# Altium project pca20020.PrjPCB (part 1 of 3)
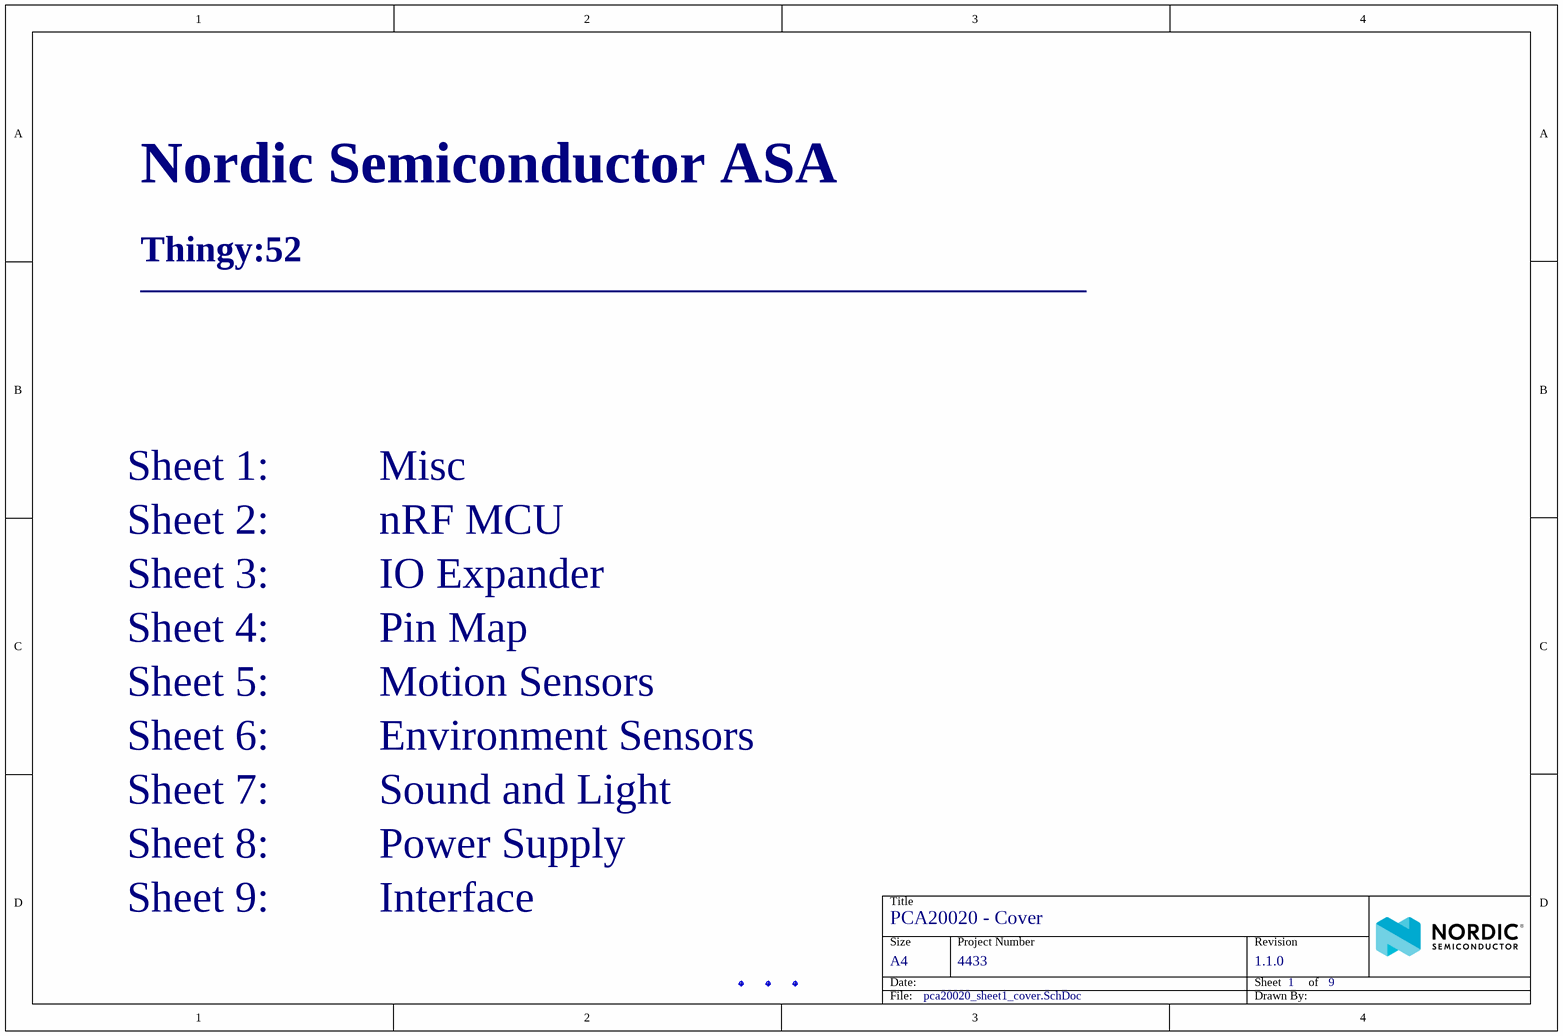
[diagram p0: pca20020_sheet1_cover.SchDoc]
SurfaceFinish: Lead-Free HASL; SoldermaskColor: Blue; SilkscreenColor: White; Revision: 1.1.0; ProjectNumber: 4433; ProjectName: Thingy:52; PCBStackup: 2001; PCBRevision: 0333RUBR; PCBNumber: 400182; PCAName: PCA20020; Organization: Nordic Semiconductor; NrOfLayers: 2; BoardTitle: Thingy:52 Board; BoardThickness: 1.6mm; Author: RUBR
9 sheets, 166 parts. Net scope: flat (ports and power ports of the same name join across sheets).
Board file: 400182.PcbDoc
Sheets:
  pca20020_sheet1_cover.SchDoc
  pca20020_sheet2_mcu.SchDoc
  pca20020_sheet3_io_expander.SchDoc
  pca20020_sheet4_pin_map.SchDoc
  pca20020_sheet5_motion_sensors.SchDoc
  pca20020_sheet6_environment_sensors.SchDoc
  pca20020_sheet7_sound_and_light.SchDoc
  pca20020_sheet8_power_supply.SchDoc
  pca20020_sheet9_interface.SchDoc

## Sheet pca20020_sheet1_cover.SchDoc: PCA20020 - Cover
size A4; Organization: Nordic Semiconductor; DocumentNumber: 1; Revision: 1.1.0; SheetNumber: 1; SheetTotal: 9; Author: RUBR; CompanyName: Nordic Semiconductor; DrawnBy: RUBR; DocumentSize: A4; ProjectName: Thingy:52

### Parts
Fid1  Fiducial mark  [Fiducial_Round-Square]  (value not drawn)
Fid2  Fiducial mark  [Fiducial_Round-Square]  (value not drawn)
Fid3  Fiducial mark  [Fiducial_Round-Square]  (value not drawn)

### Notes on the sheet
- Nordic Semiconductor ASA
- Thingy:52
- ___________________________________________
- Sheet 1:          Misc
- Sheet 2:          nRF MCU
- Sheet 4:          Pin Map
- Sheet 3:          IO Expander
- Sheet 5:          Motion Sensors
- Sheet 6:          Environment Sensors
- Sheet 7:          Sound and Light
- Sheet 8:          Power Supply
- Sheet 9:          Interface
- Title
- Size
- Date:
- A4
- Project Number
- Sheet         of
- Revision
- File:
- Drawn By:

### Library data of the parts
Fid1-Fid3 = Fid-Mark-Round-Square: Artikkelnr Noca: N.A.; Part Number: Fid-Mark-Round-Square; Manufacturer: *; Manufacturer Part Number: *; LatestRevisionDate: 2017-01-30; Pin Count: 1; Publisher: Nordic Semiconductor; Published: 2009-12-12; Value: *; Note: *; Footprint Doc: Fiducial; Part number IPS: N.A.; ComponentLink1URL: *; ComponentLink1Description: Datasheet; ComponentLink2URL: *; ComponentLink2Description: Supplier link; HelpURL: *; Supplier 1: *; Supplier Part Number 1: *; Supplier 2: *; Supplier Part Number 2: *

## Sheet pca20020_sheet2_mcu.SchDoc: PCA20020 - nRF MCU
size A4; Organization: Nordic Semiconductor; DocumentNumber: 2; Revision: 1.1.0; SheetNumber: 2; SheetTotal: 9; Author: RUBR; CompanyName: Nordic Semiconductor; DrawnBy: RUBR; DocumentSize: A4; ProjectName: Thingy:52
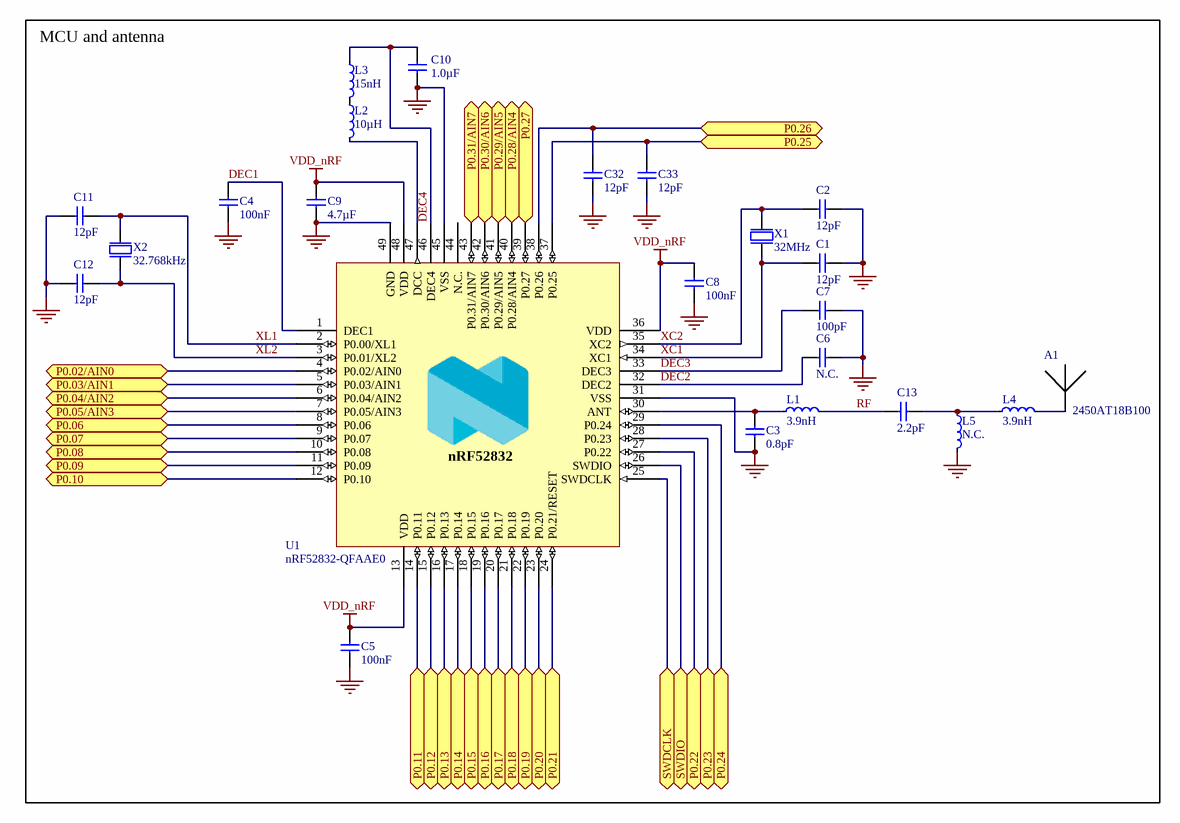
[diagram p1: pca20020_sheet2_mcu.SchDoc]

### Parts
A1  2450AT18B100  [2450AT18B100]
C1  12pF  [CAPC1005X04L]
C2  12pF  [CAPC1005X04L]
C3  0.8pF  [CAPC1005X04L]
C4  100nF  [CAPC1005X04L]
C5  100nF  [CAPC1005X04L]
C6  N.C.  [CAPC1005X04L]
C7  100pF  [CAPC1005X04L]
C8  100nF  [CAPC1005X04L]
C9  4.7µF  [CAPC1608X06L]
C10  1.0µF  [CAPC1608X06L]
C11  12pF  [CAPC1005X04L]
C12  12pF  [CAPC1005X04L]
C13  2.2pF  [CAPC1005X04L]
C32  12pF  [CAPC1005X04L]
C33  12pF  [CAPC1005X04L]
L1  3.9nH  [INDC1005X04L]
L2  10µH  [INDC1608X06L]
L3  15nH  [INDC1005X04L]
L4  3.9nH  [INDC1005X04L]
L5  N.C.  [INDC1005X04L]
U1  nRF52832-QFAAE0  [QFN40P600X600X90-48N]
X1  32MHz  [BT-XTAL_2016]
X2  32.768kHz  [XTAL_2012]

### Blocks framed on the sheet
MCU and antenna: A1 C1-C13 C32 C33 L1-L5 U1 X1 X2

### Ports
P0.02/AIN0 (bidir), P0.03/AIN1 (bidir), P0.04/AIN2 (bidir), P0.05/AIN3 (bidir), P0.06 (bidir), P0.07 (bidir), P0.08 (bidir), P0.09 (bidir), P0.10 (bidir), P0.11 (bidir), P0.12 (bidir), P0.13 (bidir), P0.14 (bidir), P0.15 (bidir), P0.16 (bidir), P0.17 (bidir), P0.18 (bidir), P0.19 (bidir), P0.20 (bidir), P0.21 (bidir), P0.22 (bidir), P0.23 (bidir), P0.24 (bidir), P0.25 (bidir), P0.26 (bidir), P0.27 (bidir), P0.28/AIN4 (bidir), P0.29/AIN5 (bidir), P0.30/AIN6 (bidir), P0.31/AIN7 (bidir), SWDCLK (bidir), SWDIO (bidir)

### Nets
GND: C1.2 C2.2 C3.1 C4.2 C5.2 C6.1 C7.2 C8.2 C9.2 C10.1 C11.2 C12.2 C32.1 C33.1 L5.2 U1.31(VSS) U1.45(VSS) U1.49(GND) X1.2(GND) X1.4(GND)
VDD_nRF: C5.1 C8.1 C9.1 U1.13(VDD) U1.36(VDD) U1.48(VDD)
DEC1: C4.1 U1.1(DEC1)
DEC2: C6.2 U1.32(DEC2)
DEC3: C7.1 U1.33(DEC3)
DEC4: C10.2 L3.1 U1.46(DEC4)
P0.02: U1.4(P0.02/AIN0) ; port P0.02/AIN0
P0.03: U1.5(P0.03/AIN1) ; port P0.03/AIN1
P0.04: U1.6(P0.04/AIN2) ; port P0.04/AIN2
P0.05: U1.7(P0.05/AIN3) ; port P0.05/AIN3
P0.06: U1.8(P0.06) ; port P0.06
P0.07: U1.9(P0.07) ; port P0.07
P0.08: U1.10(P0.08) ; port P0.08
P0.09: U1.11(P0.09) ; port P0.09
P0.10: U1.12(P0.10) ; port P0.10
P0.11: U1.14(P0.11) ; port P0.11
P0.12: U1.15(P0.12) ; port P0.12
P0.13: U1.16(P0.13) ; port P0.13
P0.14: U1.17(P0.14) ; port P0.14
P0.15: U1.18(P0.15) ; port P0.15
P0.16: U1.19(P0.16) ; port P0.16
P0.17: U1.20(P0.17) ; port P0.17
P0.18: U1.21(P0.18) ; port P0.18
P0.19: U1.22(P0.19) ; port P0.19
P0.20: U1.23(P0.20) ; port P0.20
P0.21: U1.24(P0.21/RESET) ; port P0.21
P0.22: U1.27(P0.22) ; port P0.22
P0.23: U1.28(P0.23) ; port P0.23
P0.24: U1.29(P0.24) ; port P0.24
P0.25: C33.2 U1.37(P0.25) ; port P0.25
P0.26: C32.2 U1.38(P0.26) ; port P0.26
P0.27: U1.39(P0.27) ; port P0.27
P0.28: U1.40(P0.28/AIN4) ; port P0.28/AIN4
P0.29: U1.41(P0.29/AIN5) ; port P0.29/AIN5
P0.30: U1.42(P0.30/AIN6) ; port P0.30/AIN6
P0.31: U1.43(P0.31/AIN7) ; port P0.31/AIN7
RF: C13.2 L1.2
SWDCLK: U1.25(SWDCLK) ; port SWDCLK
SWDIO: U1.26(SWDIO) ; port SWDIO
XC1: C1.1 U1.34(XC1) X1.1(inp)
XC2: C2.1 U1.35(XC2) X1.3(out)
XL1: C11.1 U1.2(P0.00/XL1) X2.1(inp)
XL2: C12.1 U1.3(P0.01/XL2) X2.2(out)
NetA1_1: A1.1 L4.2
NetC3_2: C3.2 L1.1 U1.30(ANT)
NetC13_1: C13.1 L4.1 L5.1
NetL2_1: L2.1 L3.2
NetL2_2: L2.2 U1.47(DCC)

Not connected (* = marked no-connect by the designer): U1 44(N.C.)

### Notes on the sheet
- Title
- Size
- Date:
- A4
- Project Number
- Sheet         of
- Revision
- File:
- Drawn By:
- (in symbol nRF52832-QFAAE0) nRF52832

### Library data of the parts
A1 = Johanson 2450AT18B100: 2.45 GHz chip antenna; Manufacturer: Johanson Technology; Part number IPS: 00000007781; Artikkelnr Noca: N.A.; Part Number: Johanson 2450AT18B100; Manufacturer Part Number: 2450AT18B100; Footprint Doc: 2450AT18B100; LatestRevisionDate: 2013-09-13; Pin Count: 2; Publisher: Nordic Semiconductor; Published: 2013-09-13; Value: 2450AT18B100; Note: *; ComponentLink1URL: *; ComponentLink1Description: Datasheet; ComponentLink2URL: *; ComponentLink2Description: Supplier link; HelpURL: http://www.johansontechnology.com/datasheets/antennas/2450AT18B100.pdf; Supplier 1: Digi-Key; Supplier Part Number 1: 712-1006-1-ND; Supplier 2: *; Supplier Part Number 2: *
C1 C2 C11 C12 C32 C33 = C0402-12p: Capacitor, NP0, ±2%; Part number IPS: 00000002398; Note: 50V; Artikkelnr Noca: 20029159; Part Number: C0402-12p; Manufacturer: *; Manufacturer Part Number: *; LatestRevisionDate: 2011-05-11; Pin Count: 2; Publisher: Nordic Semiconductor; Published: 2009-05-08; Value: 12pF; Footprint Doc: 0402; ComponentLink1URL: *; ComponentLink1Description: Datasheet; ComponentLink2URL: *; ComponentLink2Description: Supplier link; HelpURL: *; Supplier 1: *; Supplier Part Number 1: *; Supplier 2: *; Supplier Part Number 2: *
C3 = C0402-0.8p: Capacitor, NP0, ±5%; Part number IPS: 00000007782; Note: 50V; Artikkelnr Noca: 20029147; Part Number: C0402-0.8p; Manufacturer: *; Manufacturer Part Number: *; LatestRevisionDate: 2012-11-21; Pin Count: 2; Publisher: Nordic Semiconductor; Published: 2009-05-08; Value: 0.8pF; Footprint Doc: 0402; ComponentLink1URL: *; ComponentLink1Description: Datasheet; ComponentLink2URL: *; ComponentLink2Description: Supplier link; HelpURL: *; Supplier 1: *; Supplier Part Number 1: *; Supplier 2: *; Supplier Part Number 2: *
C4 C5 C8 = C0402-100n: Capacitor, X7R, ±10%; Part number IPS: 00000005296; Note: 16V; Artikkelnr Noca: 20039200; Part Number: C0402-100n; Manufacturer: *; Manufacturer Part Number: *; LatestRevisionDate: 2009-11-23; Pin Count: 2; Publisher: Nordic Semiconductor; Published: 2009-05-08; Value: 100nF; Footprint Doc: 0402; ComponentLink1URL: *; ComponentLink1Description: Datasheet; ComponentLink2URL: *; ComponentLink2Description: Supplier link; HelpURL: *; Supplier 1: *; Supplier Part Number 1: *; Supplier 2: *; Supplier Part Number 2: *
C6 = C0402-N.C.: Not mounted; Note: Chip Cap; Artikkelnr Noca: N.A.; Assembly: Not mounted; Part Number: C0402-N.C.; Manufacturer: *; Manufacturer Part Number: *; LatestRevisionDate: 2009-05-08; Pin Count: 2; Publisher: Nordic Semiconductor; Published: 2009-05-08; Value: N.C.; Footprint Doc: 0402; Part number IPS: N.A.; ComponentLink1URL: *; ComponentLink1Description: Datasheet; ComponentLink2URL: *; ComponentLink2Description: Supplier link; HelpURL: *; Supplier 1: *; Supplier Part Number 1: *; Supplier 2: *; Supplier Part Number 2: *
C7 = C0402-100p: Capacitor, NP0, ±5%; Part number IPS: 00000002361; Note: 50V; Artikkelnr Noca: 20029135; Part Number: C0402-100p; Manufacturer: *; Manufacturer Part Number: *; LatestRevisionDate: 2009-05-08; Pin Count: 2; Publisher: Nordic Semiconductor; Published: 2009-05-08; Value: 100pF; Footprint Doc: 0402; ComponentLink1URL: *; ComponentLink1Description: Datasheet; ComponentLink2URL: *; ComponentLink2Description: Supplier link; HelpURL: *; Supplier 1: *; Supplier Part Number 1: *; Supplier 2: *; Supplier Part Number 2: *
C9 = C0603-4µ7: Capacitor, X5R, ±10%; Part number IPS: 00000007783; Note: 6.3V; Artikkelnr Noca: 20069060; Part Number: C0603-4µ7; Manufacturer: *; Manufacturer Part Number: *; LatestRevisionDate: 2009-11-23; Pin Count: 2; Publisher: Nordic Semiconductor; Published: 2009-05-08; Value: 4.7µF; Footprint Doc: 0603; ComponentLink1URL: *; ComponentLink1Description: Datasheet; ComponentLink2URL: *; ComponentLink2Description: Supplier link; HelpURL: *; Supplier 1: *; Supplier Part Number 1: *; Supplier 2: *; Supplier Part Number 2: *
C10 = C0603-1µ0: Capacitor, X7R, ±10%; Part number IPS: 00000000616; Note: 16V; Artikkelnr Noca: 20039282; Part Number: C0603-1µ0; Manufacturer: *; Manufacturer Part Number: *; LatestRevisionDate: 2013-06-05; Pin Count: 2; Publisher: Nordic Semiconductor; Published: 2009-05-08; Value: 1.0µF; Footprint Doc: 0603; ComponentLink1URL: *; ComponentLink1Description: Datasheet; ComponentLink2URL: *; ComponentLink2Description: Supplier link; HelpURL: *; Supplier 1: *; Supplier Part Number 1: *; Supplier 2: *; Supplier Part Number 2: *
C13 = C0402-2.2p: Capacitor, NP0, ±0.1pF; Part number IPS: 00000003105; Note: 50V; Artikkelnr Noca: 20029145; Part Number: C0402-2.2p; Manufacturer: *; Manufacturer Part Number: *; LatestRevisionDate: 2017-02-23; Pin Count: 2; Publisher: Nordic Semiconductor; Published: 2009-05-08; Value: 2.2pF; Footprint Doc: 0402; ComponentLink1URL: *; ComponentLink1Description: Datasheet; ComponentLink2URL: *; ComponentLink2Description: Supplier link; HelpURL: *; Supplier 1: Digi-Key; Supplier Part Number 1: 490-8092-1-ND; Supplier 2: *; Supplier Part Number 2: *
L1 L4 = L0402-3n9: Inductor, 170mA, ±0.1nH; Manufacturer: Murata; Manufacturer Part Number: LQP15MN3N9B02D; Part number IPS: 00000007793; Note: High frequency chip inductor ±5%; Artikkelnr Noca: 33029151; Part Number: L0402-3n9; LatestRevisionDate: 2012-09-19; Pin Count: 2; Publisher: Nordic Semiconductor; Published: 2009-05-08; Value: 3.9nH; Footprint Doc: 0402; ComponentLink1Description: Datasheet; ComponentLink2Description: Supplier link; ComponentLink1URL: *; ComponentLink2URL: *; HelpURL: http://search.murata.co.jp/Ceramy/image/img/PDF/ENG/L0075S0084LQP15M.pdf; Supplier 1: Digi-Key; Supplier Part Number 1: 490-1131-1-ND; Supplier 2: *; Supplier Part Number 2: *
L2 = L0603-10µ: Inductor, 80mA, ±10%; Manufacturer: Taiyo Yuden; Manufacturer Part Number: LBMF1608T100K; Part number IPS: 00000007794; Note: LBMF1608T100K 10µH 80mA 0603; Artikkelnr Noca: 33029314; Part Number: L0603-10µ; LatestRevisionDate: 2012-09-19; Pin Count: 2; Publisher: Nordic Semiconductor; Published: 2010-02-24; Value: 10µH; Footprint Doc: 0603; ComponentLink1Description: Datasheet; ComponentLink2Description: Supplier link; ComponentLink1URL: *; ComponentLink2URL: *; HelpURL: http://www.yuden.co.jp/ut/product/pdf/elb2_e.pdf; Supplier 1: Digi-Key; Supplier Part Number 1: 587-1714-1-ND; Supplier 2: Farnell; Supplier Part Number 2: 178-6105
L3 = L0402-15n: Inductor, 320mA, ±5%; Manufacturer: Taiyo Yuden; Manufacturer Part Number: HK100515NJ-T; Part number IPS: 00000001262; Note: High frequency chip inductor ±10%; Artikkelnr Noca: 33029323; Part Number: L0402-15n; LatestRevisionDate: 2012-09-19; Pin Count: 2; Publisher: Nordic Semiconductor; Published: 2010-07-12; Value: 15nH; Footprint Doc: 0402; ComponentLink1Description: Datasheet; ComponentLink2Description: Supplier link; ComponentLink1URL: *; ComponentLink2URL: *; HelpURL: http://www.yuden.co.jp/productdata/catalog/en/mlci04_e.pdf; Supplier 1: Digi-Key; Supplier Part Number 1: 587-1521-1-ND; Supplier 2: Farnell; Supplier Part Number 2: 658-1328
L5 = L0402-N.C.: Not mounted; Artikkelnr Noca: N.A.; Assembly: Not mounted; Part Number: L0402-N.C.; Manufacturer: *; Manufacturer Part Number: *; LatestRevisionDate: 2016-11-24; Pin Count: 2; Publisher: Nordic Semiconductor; Published: 2016-11-24; Value: N.C.; Note: *; Footprint Doc: 0402; Part number IPS: N.A.; ComponentLink1Description: Datasheet; ComponentLink2Description: Supplier link; ComponentLink1URL: *; ComponentLink2URL: *; HelpURL: *; Supplier 1: *; Supplier Part Number 1: *; Supplier 2: *; Supplier Part Number 2: *
U1 = nRF52832-QFAAE0: Multi-protocol Bluetooth Low Energy, ANT and 2.4GHz proprietary system-on-chip; Manufacturer: Nordic Semiconductor; Artikkelnr Noca: N.A.; Part Number: nRF52832-QFAAE0; Manufacturer Part Number: nRF52832-QFAAE0; LatestRevisionDate: 2017-10-18; Pin Count: 48; Publisher: Nordic Semiconductor; Published: 2017-10-18; Value: nRF52832-QFAAE0; Note: *; Footprint Doc: QFN-48; Part number IPS: N.A.; ComponentLink1URL: *; ComponentLink1Description: Datasheet; ComponentLink2URL: *; ComponentLink2Description: Supplier link; HelpURL: *; Supplier 1: Nordic Semiconductor; Supplier Part Number 1: nRF52832-QFAAE0; Supplier 2: *; Supplier Part Number 2: *
X1 = XTAL_SMD2016_32MHz_8pF_Kyocera: XTAL SMD 2016, 32MHz, Cl=8pF, Tot: ±40ppm; Manufacturer Part Number: CX2016DB32000D0WZRC1; Part number IPS: 00000007827; Note: XTAL SMD 32.000MHz; Artikkelnr Noca: 22010022; Part Number: XTAL_SMD2016_32MHz_8pF_Kyocera; Manufacturer: Kyocera; LatestRevisionDate: 2016-06-02; Pin Count: 4; Publisher: Nordic Semiconductor; Published: 2015-10-15; Value: 32MHz; Footprint Doc: XTAL_2016; ComponentLink1URL: *; ComponentLink1Description: Datasheet; ComponentLink2URL: *; ComponentLink2Description: Supplier link; HelpURL: http://media.digikey.com/pdf/Data%20Sheets/AVX%20PDFs/CX2016DB32000D0WZRC1_Spec.pdf; Supplier 1: Digi-Key; Supplier Part Number 1: 1253-1586-1-ND; Supplier 2: *; Supplier Part Number 2: *
X2 = XTAL_SMD2012_32.768kHz_9pF_MC: XTAL SMD 2012, 32.768kHz, 9pF, ±20ppm; Manufacturer: Micro Crystal; Manufacturer Part Number: CM8V-T1A 32.768KHZ 9PF +/-20PPM TA QC; Part number IPS: 00000007828; Note: XTAL SMD 32.768kHz; Artikkelnr Noca: N.A.; Part Number: XTAL_SMD2012_32.768kHz_9pF_MC; LatestRevisionDate: 2017-01-30; Pin Count: 2; Publisher: Nordic Semiconductor; Published: 2016-09-15; Value: 32.768kHz; Footprint Doc: XTAL_2012; ComponentLink1URL: *; ComponentLink1Description: Datasheet; ComponentLink2URL: *; ComponentLink2Description: Supplier link; HelpURL: http://www.microcrystal.com/images/_PDF/3_Crystal_Ceramic-Package/cm8v-t1a.pdf; Supplier 1: Allied; Supplier Part Number 1: 70417961; Supplier 2: *; Supplier Part Number 2: *

## Sheet pca20020_sheet3_io_expander.SchDoc: PCA20020 - IO Expander
size A4; Organization: Nordic Semiconductor; DocumentNumber: 3; Revision: 1.1.0; SheetNumber: 3; SheetTotal: 9; Author: RUBR; CompanyName: Nordic Semiconductor; DrawnBy: RUBR; DocumentSize: A4; ProjectName: Thingy:52
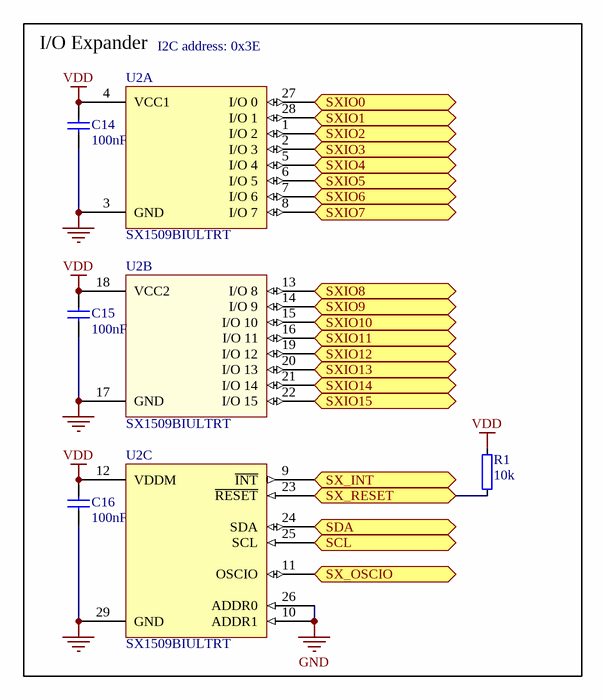
[diagram p2: pca20020_sheet3_io_expander.SchDoc]

### Parts
C14  100nF  [CAPC1005X04L]
C15  100nF  [CAPC1005X04L]
C16  100nF  [CAPC1005X04L]
R1  10k  [RESC1005X04L]
U2  SX1509BIULTRT  [QFN40P400X400X60_HS-29N]  (parts A,B,C of 3)

### Ports
SCL (bidir), SDA (bidir), SX_INT (bidir), SX_OSCIO (bidir), SX_RESET (bidir), SXIO0 (bidir), SXIO1 (bidir), SXIO2 (bidir), SXIO3 (bidir), SXIO4 (bidir), SXIO5 (bidir), SXIO6 (bidir), SXIO7 (bidir), SXIO8 (bidir), SXIO9 (bidir), SXIO10 (bidir), SXIO11 (bidir), SXIO12 (bidir), SXIO13 (bidir), SXIO14 (bidir), SXIO15 (bidir)

### Nets
GND: C14.1 C15.1 C16.1 U2.3(GND) U2.10(ADDR1) U2.17(GND) U2.26(ADDR0) U2.29(GND)
VDD: C14.2 C15.2 C16.2 R1.2 U2.4(VCC1) U2.12(VDDM) U2.18(VCC2)
BAT_MON_EN: U2.5(I/O_4) ; port SXIO4
CCS_PWR_CTRL: U2.15(I/O_10) ; port SXIO10
CCS_RESET: U2.16(I/O_11) ; port SXIO11
CCS_WAKE: U2.19(I/O_12) ; port SXIO12
IOEXT0: U2.27(I/O_0) ; port SXIO0
IOEXT1: U2.28(I/O_1) ; port SXIO1
IOEXT2: U2.1(I/O_2) ; port SXIO2
IOEXT3: U2.2(I/O_3) ; port SXIO3
LIGHTWELL_B: U2.7(I/O_6) ; port SXIO6
LIGHTWELL_G: U2.6(I/O_5) ; port SXIO5
LIGHTWELL_R: U2.8(I/O_7) ; port SXIO7
MIC_PWR_CTRL: U2.14(I/O_9) ; port SXIO9
MPU_PWR_CTRL: U2.13(I/O_8) ; port SXIO8
P0.05: U2.11(OSCIO) ; port SX_OSCIO
P0.07: U2.24(SDA) ; port SDA
P0.08: U2.25(SCL) ; port SCL
P0.16: R1.1 U2.23(~{RESET}) ; port SX_RESET
SENSE_LED_B: U2.22(I/O_15) ; port SXIO15
SENSE_LED_G: U2.21(I/O_14) ; port SXIO14
SENSE_LED_R: U2.20(I/O_13) ; port SXIO13
SX_INT: U2.9(~{INT}) ; port SX_INT

### Notes on the sheet
- I/O Expander
- (near U2) I2C address: 0x3E
- Title
- Size
- Date:
- A4
- Project Number
- Sheet         of
- Revision
- File:
- Drawn By:

### Library data of the parts
C14-C16 = C0402-100n: as C4 on sheet pca20020_sheet2_mcu; Part Number: C0402-100n; Manufacturer: *; Manufacturer Part Number: *; Footprint Doc: 0402; LatestRevisionDate: 2009-11-23; Pin Count: 2; Publisher: Nordic Semiconductor; Published: 2009-05-08; Value: 100nF; ComponentLink1URL: *; ComponentLink1Description: Datasheet; ComponentLink2URL: *; ComponentLink2Description: Supplier link; HelpURL: *; Supplier 1: *; Supplier Part Number 1: *; Supplier 2: *; Supplier Part Number 2: *
R1 = R0402-10k: Resistor, ±1%, 0.063W; Part number IPS: 00000002093; Note: Chip Res 1%; Artikkelnr Noca: 27049097; Part Number: R0402-10k; Manufacturer: *; Manufacturer Part Number: *; Footprint Doc: 0402; LatestRevisionDate: 2009-11-23; Pin Count: 2; Publisher: Nordic Semiconductor; Published: 2009-05-08; Value: 10k; ComponentLink1URL: *; ComponentLink1Description: Datasheet; ComponentLink2URL: *; ComponentLink2Description: Supplier link; HelpURL: *; Supplier 1: Farnell; Supplier Part Number 1: 173-8864; Supplier 2: *; Supplier Part Number 2: *
U2 = SX1509BIULTRT: IC GPIO EXPANDER I2C 16CH 28QFN; Manufacturer: Semtech Corporation; Part number IPS: 00000007814; Artikkelnr Noca: N.A.; Part Number: SX1509BIULTRT; Manufacturer Part Number: SX1509BIULTRT; Footprint Doc: QFN-28; LatestRevisionDate: 2015-03-10; Pin Count: 29; Publisher: Nordic Semiconductor; Published: 2015-03-10; Value: SX1509BIULTRT; Note: *; ComponentLink1URL: *; ComponentLink1Description: Datasheet; ComponentLink2URL: *; ComponentLink2Description: Supplier link; HelpURL: http://www.semtech.com/apps/product.php?pn=sx1509&x=0&y=0; Supplier 1: Digi-Key; Supplier Part Number 1: SX1509BIULCT-ND; Supplier 2: *; Supplier Part Number 2: *

## Sheet pca20020_sheet4_pin_map.SchDoc: PCA20020 - Pin Map
size A4; Organization: Nordic Semiconductor; DocumentNumber: 4; Revision: 1.1.0; SheetNumber: 4; SheetTotal: 9; Author: RUBR; CompanyName: Nordic Semiconductor; DrawnBy: RUBR; DocumentSize: A4; ProjectName: Thingy:52
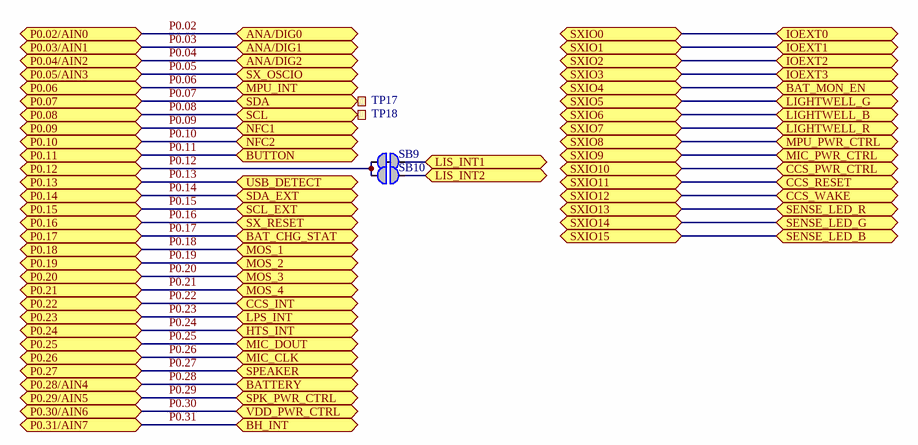
[diagram p3: pca20020_sheet4_pin_map.SchDoc]

### Parts
SB9  Solderbridge  [Solderbridge_Shorted]  (value not drawn)  (net tie, no BOM)
SB10  Solderbridge  [Solderbridge]  (value not drawn)  (no BOM)
TP17  Ø1.5mm,SMD  [TP_SMD_Ø1.5mm]  (value not drawn)  (no BOM)
TP18  Ø1.5mm,SMD  [TP_SMD_Ø1.5mm]  (value not drawn)  (no BOM)

### Ports
ANA/DIG0 (bidir), ANA/DIG1 (bidir), ANA/DIG2 (bidir), BAT_CHG_STAT (bidir), BAT_MON_EN (bidir), BATTERY (bidir), BH_INT (bidir), BUTTON (bidir), CCS_INT (bidir), CCS_PWR_CTRL (bidir), CCS_RESET (bidir), CCS_WAKE (bidir), HTS_INT (bidir), IOEXT0 (bidir), IOEXT1 (bidir), IOEXT2 (bidir), IOEXT3 (bidir), LIGHTWELL_B (bidir), LIGHTWELL_G (bidir), LIGHTWELL_R (bidir), LIS_INT1 (bidir), LIS_INT2 (bidir), LPS_INT (bidir), MIC_CLK (bidir), MIC_DOUT (bidir), MIC_PWR_CTRL (bidir), MOS_1 (bidir), MOS_2 (bidir), MOS_3 (bidir), MOS_4 (bidir), MPU_INT (bidir), MPU_PWR_CTRL (bidir), NFC1 (bidir), NFC2 (bidir), P0.02/AIN0 (bidir), P0.03/AIN1 (bidir), P0.04/AIN2 (bidir), P0.05/AIN3 (bidir), P0.06 (bidir), P0.07 (bidir), P0.08 (bidir), P0.09 (bidir), P0.10 (bidir), P0.11 (bidir), P0.12 (bidir), P0.13 (bidir), P0.14 (bidir), P0.15 (bidir), P0.16 (bidir), P0.17 (bidir), P0.18 (bidir), P0.19 (bidir), P0.20 (bidir), P0.21 (bidir), P0.22 (bidir), P0.23 (bidir), P0.24 (bidir), P0.25 (bidir), P0.26 (bidir), P0.27 (bidir), P0.28/AIN4 (bidir), P0.29/AIN5 (bidir), P0.30/AIN6 (bidir), P0.31/AIN7 (bidir), SCL (bidir), SCL_EXT (bidir), SDA (bidir), SDA_EXT (bidir), SENSE_LED_B (bidir), SENSE_LED_G (bidir), SENSE_LED_R (bidir), SPEAKER (bidir), SPK_PWR_CTRL (bidir), SX_OSCIO (bidir), SX_RESET (bidir), SXIO0 (bidir), SXIO1 (bidir), SXIO2 (bidir), SXIO3 (bidir), SXIO4 (bidir), SXIO5 (bidir), SXIO6 (bidir), SXIO7 (bidir), SXIO8 (bidir), SXIO9 (bidir), SXIO10 (bidir), SXIO11 (bidir), SXIO12 (bidir), SXIO13 (bidir), SXIO14 (bidir), SXIO15 (bidir), USB_DETECT (bidir), VDD_PWR_CTRL (bidir)

### Nets
BAT_MON_EN: port SXIO4, port BAT_MON_EN
CCS_PWR_CTRL: port CCS_PWR_CTRL, port SXIO10
CCS_RESET: port CCS_RESET, port SXIO11
CCS_WAKE: port CCS_WAKE, port SXIO12
IOEXT0: port SXIO0, port IOEXT0
IOEXT1: port SXIO1, port IOEXT1
IOEXT2: port SXIO2, port IOEXT2
IOEXT3: port SXIO3, port IOEXT3
LIGHTWELL_B: port SXIO6, port LIGHTWELL_B
LIGHTWELL_G: port SXIO5, port LIGHTWELL_G
LIGHTWELL_R: port SXIO7, port LIGHTWELL_R
LIS_INT1: SB9.1 ; port LIS_INT1
LIS_INT2: SB10.1 ; port LIS_INT2
MIC_PWR_CTRL: port MIC_PWR_CTRL, port SXIO9
MPU_PWR_CTRL: port MPU_PWR_CTRL, port SXIO8
P0.02: port P0.02/AIN0, port ANA/DIG0
P0.03: port P0.03/AIN1, port ANA/DIG1
P0.04: port P0.04/AIN2, port ANA/DIG2
P0.05: port P0.05/AIN3, port SX_OSCIO
P0.06: port MPU_INT, port P0.06
P0.07: TP17.1 ; port SDA, port P0.07
P0.08: TP18.1 ; port SCL, port P0.08
P0.09: port NFC1, port P0.09
P0.10: port NFC2, port P0.10
P0.11: port P0.11, port BUTTON
P0.12: SB9.2 SB10.2 ; port P0.12
P0.13: port P0.13, port USB_DETECT
P0.14: port P0.14, port SDA_EXT
P0.15: port P0.15, port SCL_EXT
P0.16: port P0.16, port SX_RESET
P0.17: port P0.17, port BAT_CHG_STAT
P0.18: port MOS_1, port P0.18
P0.19: port MOS_2, port P0.19
P0.20: port MOS_3, port P0.20
P0.21: port MOS_4, port P0.21
P0.22: port P0.22, port CCS_INT
P0.23: port LPS_INT, port P0.23
P0.24: port P0.24, port HTS_INT
P0.25: port MIC_DOUT, port P0.25
P0.26: port MIC_CLK, port P0.26
P0.27: port SPEAKER, port P0.27
P0.28: port BATTERY, port P0.28/AIN4
P0.29: port P0.29/AIN5, port SPK_PWR_CTRL
P0.30: port P0.30/AIN6, port VDD_PWR_CTRL
P0.31: port P0.31/AIN7, port BH_INT
SENSE_LED_B: port SXIO15, port SENSE_LED_B
SENSE_LED_G: port SXIO14, port SENSE_LED_G
SENSE_LED_R: port SXIO13, port SENSE_LED_R

### Notes on the sheet
- Title
- Size
- Date:
- A4
- Project Number
- Sheet         of
- Revision
- File:
- Drawn By:

### Library data of the parts
SB9 = Solderbridge Shorted: Shorted Solderbridge; Artikkelnr Noca: N.A.; Part Number: Solderbridge Shorted; Manufacturer: *; Manufacturer Part Number: *; Footprint Doc: Solderbridge_Shorted; LatestRevisionDate: 2012-08-07; Pin Count: 2; Publisher: Nordic Semiconductor; Published: 2012-08-07; Value: Solderbridge; Note: *; Part number IPS: N.A.; ComponentLink1URL: *; ComponentLink1Description: Datasheet; ComponentLink2URL: *; ComponentLink2Description: Supplier link; HelpURL: *; Supplier 1: *; Supplier Part Number 1: *; Supplier 2: *; Supplier Part Number 2: *
SB10 = Solderbridge: Artikkelnr Noca: N.A.; Part Number: Solderbridge; Manufacturer: *; Manufacturer Part Number: *; Footprint Doc: Solderbridge; LatestRevisionDate: 2009-12-14; Pin Count: 2; Publisher: Nordic Semiconductor; Published: 2009-12-14; Value: Solderbridge; Note: *; Part number IPS: N.A.; ComponentLink1URL: *; ComponentLink1Description: Datasheet; ComponentLink2URL: *; ComponentLink2Description: Supplier link; HelpURL: *; Supplier 1: *; Supplier Part Number 1: *; Supplier 2: *; Supplier Part Number 2: *
TP17 TP18 = TP_SMD_Ø1.5MM: 1.0mm circular SMD testpad; Manufacturer: Nordic Semiconductor; Artikkelnr Noca: N.A.; Part Number: TP_SMD_Ø1.5MM; Manufacturer Part Number: *; Footprint Doc: TP_SMD_Ø1.5mm; LatestRevisionDate: 2016-06-02; Pin Count: 1; Publisher: Nordic Semiconductor; Published: 2016-06-02; Value: Ø1.5mm,SMD; Note: *; Part number IPS: N.A.; ComponentLink1URL: *; ComponentLink1Description: Datasheet; ComponentLink2URL: *; ComponentLink2Description: Supplier link; HelpURL: *; Supplier 1: *; Supplier Part Number 1: *; Supplier 2: *; Supplier Part Number 2: *

## Sheet pca20020_sheet5_motion_sensors.SchDoc: PCA20020 - Motion Sensors
size A4; Organization: Nordic Semiconductor; DocumentNumber: 5; Revision: 1.1.0; SheetNumber: 5; SheetTotal: 9; Author: RUBR; CompanyName: Nordic Semiconductor; DrawnBy: RUBR; DocumentSize: A4; ProjectName: Thingy:52
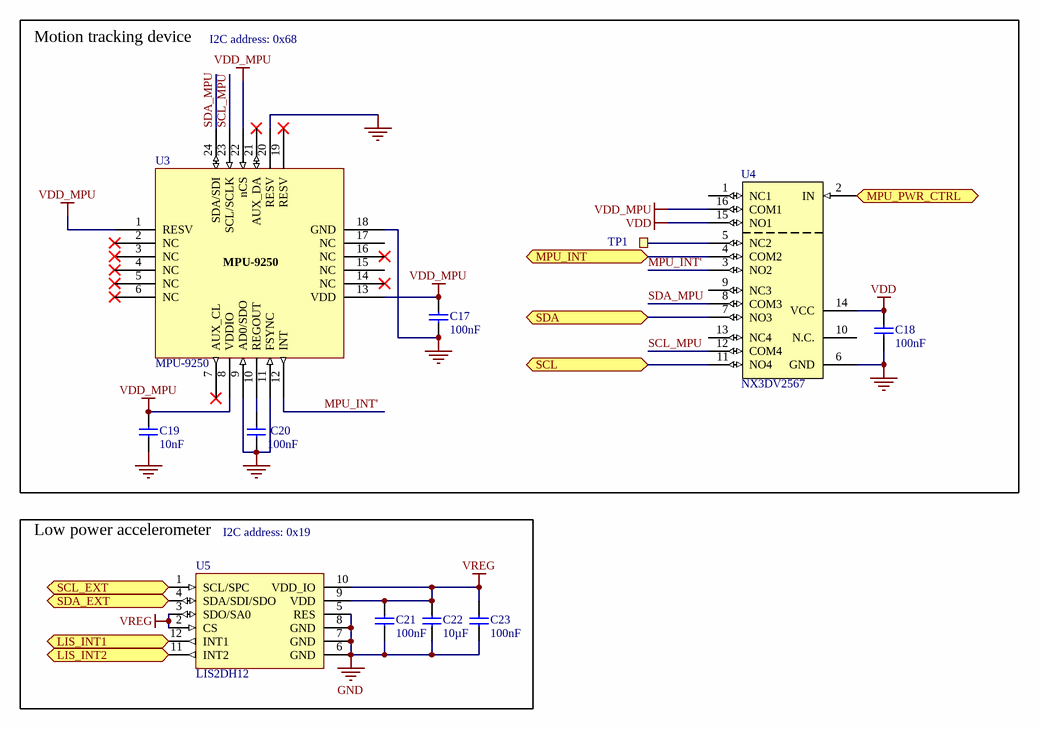
[diagram p4: pca20020_sheet5_motion_sensors.SchDoc]

### Parts
C17  100nF  [CAPC1005X04L]
C18  100nF  [CAPC1005X04L]
C19  10nF  [CAPC1005X04L]
C20  100nF  [CAPC1005X04L]
C21  100nF  [CAPC1005X04L]
C22  10µF  [CAPC1608X06L]
C23  100nF  [CAPC1005X04L]
TP1  TP  [TESTPAD-TH]  (value not drawn)  (no BOM)
U3  MPU-9250  [QFN40P300X300X105_HS-25N]
U4  NX3DV2567  [XQFN40P180X260X50-16N]
U5  LIS2DH12  [LGA50P200X200X100-12N]

### Blocks framed on the sheet
Motion tracking device: C17-C20 TP1 U3 U4
Low power accelerometer: C21-C23 U5

### Ports
LIS_INT1 (bidir), LIS_INT2 (bidir), MPU_INT (bidir), MPU_PWR_CTRL (bidir), SCL (bidir), SCL_EXT (bidir), SDA (bidir), SDA_EXT (bidir)

### Nets
GND: C17.1 C18.1 C19.1 C20.1 C21.1 C22.1 C23.1 U3.9(AD0/SDO) U3.11(FSYNC) U3.18(GND) U3.20(RESV) U4.6(GND) U5.5(RES) U5.6(GND) U5.7(GND) U5.8(GND)
VDD: C18.2 U4.14(VCC) U4.15(NO1)
VDD_MPU: C17.2 C19.2 U3.1(RESV) U3.8(VDDIO) U3.13(VDD) U3.22(nCS) U4.16(COM1)
VREG: C21.2 C22.2 C23.2 U5.2(CS) U5.3(SDO/SA0) U5.9(VDD) U5.10(VDD_IO)
LIS_INT1: U5.12(INT1) ; port LIS_INT1
LIS_INT2: U5.11(INT2) ; port LIS_INT2
MPU_INT': U3.12(INT) U4.3(NO2)
MPU_PWR_CTRL: U4.2(IN) ; port MPU_PWR_CTRL
P0.06: U4.4(COM2) ; port MPU_INT
P0.07: U4.7(NO3) ; port SDA
P0.08: U4.11(NO4) ; port SCL
P0.14: U5.4(SDA/SDI/SDO) ; port SDA_EXT
P0.15: U5.1(SCL/SPC) ; port SCL_EXT
SCL_MPU: U3.23(SCL/SCLK) U4.12(COM4)
SDA_MPU: U3.24(SDA/SDI) U4.8(COM3)
NetC20_2: C20.2 U3.10(REGOUT)
NetTP1_1: TP1.1 U4.5(NC2)

Not connected (* = marked no-connect by the designer): U3 2(NC)* 3(NC)* 4(NC)* 5(NC)* 6(NC)* 7(AUX_CL)* 14(NC)* 15(NC) 16(NC)* 17(NC) 19(RESV)* 21(AUX_DA)*; U4 1(NC1) 9(NC3) 10(N.C.) 13(NC4)

### Notes on the sheet
- I2C address: 0x68
- (near U5) I2C address: 0x19
- Title
- Size
- Date:
- A4
- Project Number
- Sheet         of
- Revision
- File:
- Drawn By:

### Library data of the parts
C17 C18 C20 C21 C23 = C0402-100n: as C4 on sheet pca20020_sheet2_mcu; Part Number: C0402-100n; Manufacturer: *; Manufacturer Part Number: *; LatestRevisionDate: 2009-11-23; Pin Count: 2; Publisher: Nordic Semiconductor; Published: 2009-05-08; Value: 100nF; Footprint Doc: 0402; ComponentLink1URL: *; ComponentLink1Description: Datasheet; ComponentLink2URL: *; ComponentLink2Description: Supplier link; HelpURL: *; Supplier 1: *; Supplier Part Number 1: *; Supplier 2: *; Supplier Part Number 2: *
C19 = C0402-10n: Capacitor, X7R, ±10%; Part number IPS: 00000007784; Note: 16V; Artikkelnr Noca: 20039166; Part Number: C0402-10n; Manufacturer: *; Manufacturer Part Number: *; LatestRevisionDate: 2009-11-23; Pin Count: 2; Publisher: Nordic Semiconductor; Published: 2009-05-08; Value: 10nF; Footprint Doc: 0402; ComponentLink1URL: *; ComponentLink1Description: Datasheet; ComponentLink2URL: *; ComponentLink2Description: Supplier link; HelpURL: *; Supplier 1: *; Supplier Part Number 1: *; Supplier 2: *; Supplier Part Number 2: *
C22 = C0603-10µ: Capacitor, X5R, ±20%; Part number IPS: 00000007785; Note: 6.3V; Artikkelnr Noca: 20039234; Part Number: C0603-10µ; Manufacturer: *; Manufacturer Part Number: *; Footprint Doc: 0603; LatestRevisionDate: 2011-01-17; Pin Count: 2; Publisher: Nordic Semiconductor; Published: 2011-01-17; Value: 10µF; ComponentLink1URL: *; ComponentLink1Description: Datasheet; ComponentLink2URL: *; ComponentLink2Description: Supplier link; HelpURL: *; Supplier 1: *; Supplier Part Number 1: *; Supplier 2: *; Supplier Part Number 2: *
TP1 = Testpoint TH: Testpoint, through hole; Artikkelnr Noca: N.A.; Part Number: Testpoint TH; Manufacturer: *; Manufacturer Part Number: *; Footprint Doc: TESTPAD-TH; LatestRevisionDate: 2009-12-12; Pin Count: 1; Publisher: Nordic Semiconductor; Published: 2009-12-12; Value: TP; Note: *; Part number IPS: N.A.; ComponentLink1URL: *; ComponentLink1Description: Datasheet; ComponentLink2URL: *; ComponentLink2Description: Supplier link; HelpURL: *; Supplier 1: *; Supplier Part Number 1: *; Supplier 2: *; Supplier Part Number 2: *
U3 = MPU-9250: 9-axis MotionTracking™ Device; Manufacturer: InvenSense; Part number IPS: 00000007815; Note: 3-Axis Gyro, 3-Axis Accel and 3-Axis Compass; Artikkelnr Noca: N.A.; Part Number: MPU-9250; Manufacturer Part Number: MPU-9250; Footprint Doc: QFN-24; LatestRevisionDate: 2015-06-24; Pin Count: 24; Publisher: Nordic Semiconductor; Published: 2015-06-24; Value: MPU-9250; ComponentLink1URL: *; ComponentLink1Description: Datasheet; ComponentLink2URL: *; ComponentLink2Description: Supplier link; HelpURL: http://43zrtwysvxb2gf29r5o0athu.wpengine.netdna-cdn.com/wp-content/uploads/2015/02/MPU-9250-Datasheet.pdf; Supplier 1: Digi-Key; Supplier Part Number 1: 1428-1019-1-ND; Supplier 2: *; Supplier Part Number 2: *
U4 = NX3DV2567GU: Low-ohmic four-pole double-throw analog switch; Manufacturer: NXP Semiconductors; Part number IPS: 00000007816; Artikkelnr Noca: 15079317; Part Number: NX3DV2567GU; Manufacturer Part Number: NX3DV2567GU; Footprint Doc: XQFN-16; LatestRevisionDate: 2015-02-17; Pin Count: 16; Publisher: Nordic Semiconductor; Published: 2015-02-17; Value: NX3DV2567; Note: *; Supplier 1: Digi-Key; Supplier Part Number 1: 568-5206-1-ND; Supplier 2: Mouser; Supplier Part Number 2: 771-NX3DV2567GU115; ComponentLink1URL: *; ComponentLink1Description: Datasheet; ComponentLink2URL: *; ComponentLink2Description: Supplier link; HelpURL: http://www.nxp.com/documents/data_sheet/NX3DV2567.pdf
U5 = LIS2DH12: 3-axis - ±2g/±4g/±8g/±16g digital output femto accelerometer; Manufacturer: STMicroelectronics; Part number IPS: 00000007817; Note: MEMS digital output motion sensor ultra low-power high performance 3-axes "femto" accelerometer; Artikkelnr Noca: N.A.; Part Number: LIS2DH12; Manufacturer Part Number: LIS2DH12; Footprint Doc: LGA-12; LatestRevisionDate: 2015-09-29; Pin Count: 12; Publisher: Nordic Semiconductor; Published: 2015-09-29; Value: LIS2DH12; ComponentLink1URL: *; ComponentLink1Description: Datasheet; ComponentLink2URL: *; ComponentLink2Description: Supplier link; HelpURL: http://www.st.com/st-web-ui/static/active/en/resource/technical/document/datasheet/DM00091513.pdf; Supplier 1: Digi-Key; Supplier Part Number 1: 497-14851-1-ND; Supplier 2: Farnell; Supplier Part Number 2: 243-3081

## Sheet pca20020_sheet6_environment_sensors.SchDoc: PCA20020 - Environment Sensors
size A4; Organization: Nordic Semiconductor; DocumentNumber: 6; Revision: 1.1.0; SheetNumber: 6; SheetTotal: 9; Author: RUBR; CompanyName: Nordic Semiconductor; DrawnBy: RUBR; DocumentSize: A4; ProjectName: Thingy:52
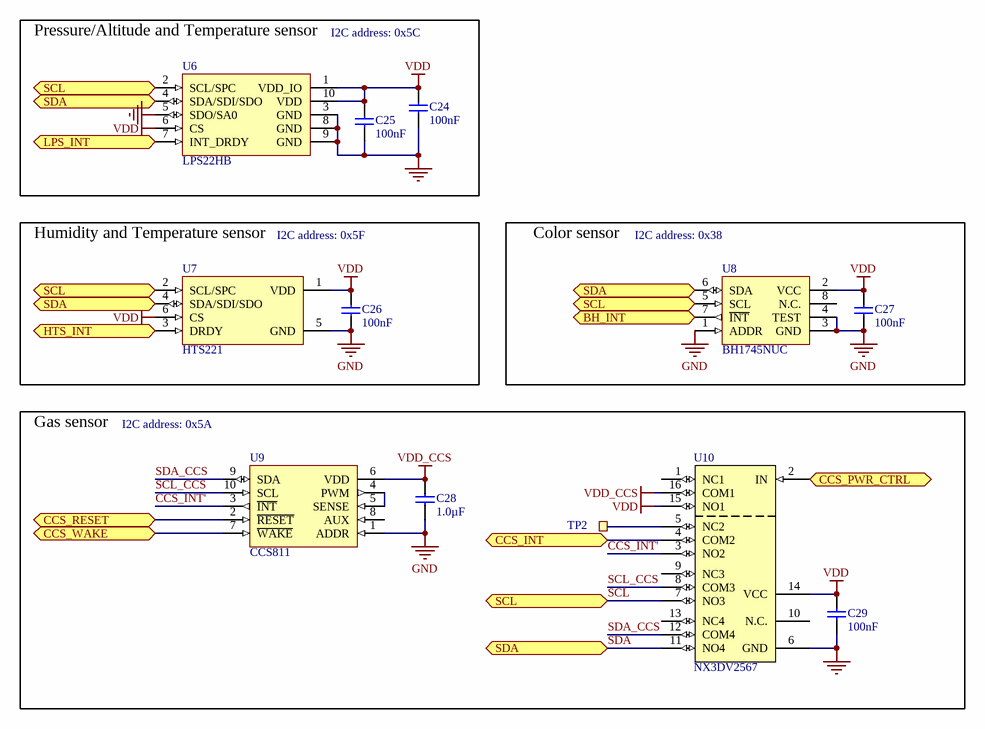
[diagram p5: pca20020_sheet6_environment_sensors.SchDoc]

### Parts
C24  100nF  [CAPC1005X04L]
C25  100nF  [CAPC1005X04L]
C26  100nF  [CAPC1005X04L]
C27  100nF  [CAPC1005X04L]
C28  1.0µF  [CAPC1005X04L]
C29  100nF  [CAPC1005X04L]
TP2  TP  [TESTPAD-TH]  (value not drawn)  (no BOM)
U6  LPS22HB  [LGA50P200X200X80-10N]
U7  HTS221  [HLGA100P200X200X100-6N]
U8  BH1745NUC  [WSON50P210X210X60_HS-9N]
U9  CCS811  [LGA60P270X400X110_HS-11N]
U10  NX3DV2567  [XQFN40P180X260X50-16N]

### Blocks framed on the sheet
Pressure/Altitude and Temperature sensor: C24 C25 U6
Humidity and Temperature sensor: C26 U7
Color sensor: C27 U8
Gas sensor: C28 C29 TP2 U9 U10

### Ports
BH_INT (bidir), CCS_INT (bidir), CCS_PWR_CTRL (bidir), CCS_RESET (bidir), CCS_WAKE (bidir), HTS_INT (bidir), LPS_INT (bidir), SCL (bidir), SDA (bidir)

### Nets
GND: C24.1 C25.1 C26.1 C27.1 C28.1 C29.1 U6.3(GND) U6.5(SDO/SA0) U6.8(GND) U6.9(GND) U7.5(GND) U8.1(ADDR) U8.3(GND) U8.4(TEST) U8.9(GND) U9.1(ADDR) U9.11(GND) U10.6(GND)
VDD: C24.2 C25.2 C26.2 C27.2 C29.2 U6.1(VDD_IO) U6.6(CS) U6.10(VDD) U7.1(VDD) U7.6(CS) U8.2(VCC) U10.14(VCC) U10.15(NO1)
VDD_CCS: C28.2 U9.6(VDD) U10.16(COM1)
CCS_INT': U9.3(~{INT}) U10.3(NO2)
CCS_PWR_CTRL: U10.2(IN) ; port CCS_PWR_CTRL
CCS_RESET: U9.2(~{RESET}) ; port CCS_RESET
CCS_WAKE: U9.7(~{WAKE}) ; port CCS_WAKE
P0.22: U10.4(COM2) ; port CCS_INT
P0.23: U6.7(INT_DRDY) ; port LPS_INT
P0.24: U7.3(DRDY) ; port HTS_INT
P0.31: U8.7(~{INT}) ; port BH_INT
SCL: U6.2(SCL/SPC) U7.2(SCL/SPC) U8.5(SCL) U10.7(NO3) ; port SCL  [project net P0.08]
SCL_CCS: U9.10(SCL) U10.8(COM3)
SDA: U6.4(SDA/SDI/SDO) U7.4(SDA/SDI/SDO) U8.6(SDA) U10.11(NO4) ; port SDA  [project net P0.07]
SDA_CCS: U9.9(SDA) U10.12(COM4)
NetTP2_1: TP2.1 U10.5(NC2)
NetU9_4: U9.4(PWM) U9.5(SENSE)

Not connected (* = marked no-connect by the designer): U8 8(N.C.); U9 8(AUX); U10 1(NC1) 9(NC3) 10(N.C.) 13(NC4)

### Notes on the sheet
- I2C address: 0x5C
- I2C address: 0x5F
- (near U8) I2C address: 0x38
- (near U9) I2C address: 0x5A
- Title
- Size
- Date:
- A4
- Project Number
- Sheet         of
- Revision
- File:
- Drawn By:

### Library data of the parts
C24-C27 C29 = C0402-100n: as C4 on sheet pca20020_sheet2_mcu; Part Number: C0402-100n; Manufacturer: *; Manufacturer Part Number: *; Footprint Doc: 0402; LatestRevisionDate: 2009-11-23; Pin Count: 2; Publisher: Nordic Semiconductor; Published: 2009-05-08; Value: 100nF; ComponentLink1URL: *; ComponentLink1Description: Datasheet; ComponentLink2URL: *; ComponentLink2Description: Supplier link; HelpURL: *; Supplier 1: *; Supplier Part Number 1: *; Supplier 2: *; Supplier Part Number 2: *
C28 = C0402-1µ0: Capacitor, X5R, ±5%, 6.3V; Part number IPS: 00000007786; Artikkelnr Noca: 20039235; Part Number: C0402-1µ0; Manufacturer: *; Manufacturer Part Number: *; Footprint Doc: 0402; LatestRevisionDate: 2016-08-22; Pin Count: 2; Publisher: Nordic Semiconductor; Published: 2009-05-08; Value: 1.0µF; Note: 6.3V; ComponentLink1URL: *; ComponentLink1Description: Datasheet; ComponentLink2URL: *; ComponentLink2Description: Supplier link; HelpURL: *; Supplier 1: Digi-Key; Supplier Part Number 1: 1276-1444-1-ND; Supplier 2: *; Supplier Part Number 2: *
TP2 = Testpoint TH: as TP1 on sheet pca20020_sheet5_motion_sensors; Part Number: Testpoint TH; Manufacturer: *; Manufacturer Part Number: *; Footprint Doc: TESTPAD-TH; LatestRevisionDate: 2009-12-12; Pin Count: 1; Publisher: Nordic Semiconductor; Published: 2009-12-12; Value: TP; Note: *; Part number IPS: N.A.; ComponentLink1URL: *; ComponentLink1Description: Datasheet; ComponentLink2URL: *; ComponentLink2Description: Supplier link; HelpURL: *; Supplier 1: *; Supplier Part Number 1: *; Supplier 2: *; Supplier Part Number 2: *
U6 = LPS22HB: MEMS nano pressure sensor: 260-1260 hPa absolute digital output barometer; Manufacturer: STMicroelectronics; Part number IPS: 00000007818; Artikkelnr Noca: N.A.; Part Number: LPS22HB; Manufacturer Part Number: LPS22HB; Footprint Doc: HLGA-10L; LatestRevisionDate: 2016-06-20; Pin Count: 10; Publisher: Nordic Semiconductor; Published: 2016-06-20; Value: LPS22HB; Note: *; ComponentLink1URL: *; ComponentLink1Description: Datasheet; ComponentLink2URL: *; ComponentLink2Description: Supplier link; HelpURL: http://www.st.com/content/ccc/resource/technical/document/datasheet/bf/c1/4f/23/61/17/44/8a/DM00140895.pdf/files/DM00140895.pdf/jcr:content/translations/en.DM00140895.pdf; Supplier 1: Digi-Key; Supplier Part Number 1: 497-16265-1-ND; Supplier 2: Mouser; Supplier Part Number 2: 511-LPS22HBTR
U7 = HTS221: Capacitive digital sensor for relative humidity and temperature; Manufacturer: STMicroelectronics; Part number IPS: 00000007819; Artikkelnr Noca: N.A.; Part Number: HTS221; Manufacturer Part Number: HTS221; Footprint Doc: HLGA-6L; LatestRevisionDate: 2016-09-15; Pin Count: 6; Publisher: Nordic Semiconductor; Published: 2016-09-15; Value: HTS221; Note: *; ComponentLink1URL: *; ComponentLink1Description: Datasheet; ComponentLink2URL: *; ComponentLink2Description: Supplier link; HelpURL: http://www.st.com/content/ccc/resource/technical/document/datasheet/4d/9a/9c/ad/25/07/42/34/DM00116291.pdf/files/DM00116291.pdf/jcr:content/translations/en.DM00116291.pdf; Supplier 1: Digi-Key; Supplier Part Number 1: 497-15382-1-ND; Supplier 2: Mouser; Supplier Part Number 2: 511-HTS221TR
U8 = BH1745NUC: Digital 16bit Serial Output Type Color Sensor IC; Manufacturer: Rohm Semiconductor; Part number IPS: 00000007820; Artikkelnr Noca: N.A.; Part Number: BH1745NUC; Manufacturer Part Number: BH1745NUC; Footprint Doc: WSON-8; LatestRevisionDate: 2015-10-07; Pin Count: 8; Publisher: Nordic Semiconductor; Published: 2015-10-07; Value: BH1745NUC; Note: *; ComponentLink1URL: *; ComponentLink1Description: Datasheet; ComponentLink2URL: *; ComponentLink2Description: Supplier link; HelpURL: http://rohmfs.rohm.com/en/products/databook/datasheet/ic/sensor/light/bh1745nuc-e.pdf; Supplier 1: Digi-Key; Supplier Part Number 1: BH1745NUC-E2CT-ND; Supplier 2: *; Supplier Part Number 2: *
U9 = CCS811: Ultra-low power digital gas sensor for monitoring indoor air quality; Manufacturer: Cambridge CMOS Sensors; Part number IPS: 00000007821; Artikkelnr Noca: N.A.; Part Number: CCS811; Manufacturer Part Number: CCS811; Footprint Doc: LGA-10; LatestRevisionDate: 2015-11-04; Pin Count: 10; Publisher: Nordic Semiconductor; Published: 2015-11-04; Value: CCS811; Note: *; ComponentLink1URL: *; ComponentLink1Description: Datasheet; ComponentLink2URL: *; ComponentLink2Description: Supplier link; HelpURL: *; Supplier 1: *; Supplier Part Number 1: *; Supplier 2: *; Supplier Part Number 2: *
U10 = NX3DV2567GU: as U4 on sheet pca20020_sheet5_motion_sensors; Part Number: NX3DV2567GU; Manufacturer Part Number: NX3DV2567GU; Footprint Doc: XQFN-16; LatestRevisionDate: 2015-02-17; Pin Count: 16; Publisher: Nordic Semiconductor; Published: 2015-02-17; Value: NX3DV2567; Note: *; Supplier 1: Digi-Key; Supplier Part Number 1: 568-5206-1-ND; Supplier 2: Mouser; Supplier Part Number 2: 771-NX3DV2567GU115; ComponentLink1URL: *; ComponentLink1Description: Datasheet; ComponentLink2URL: *; ComponentLink2Description: Supplier link; HelpURL: http://www.nxp.com/documents/data_sheet/NX3DV2567.pdf